# Altium schematic sheet tach.SchDoc
size A4
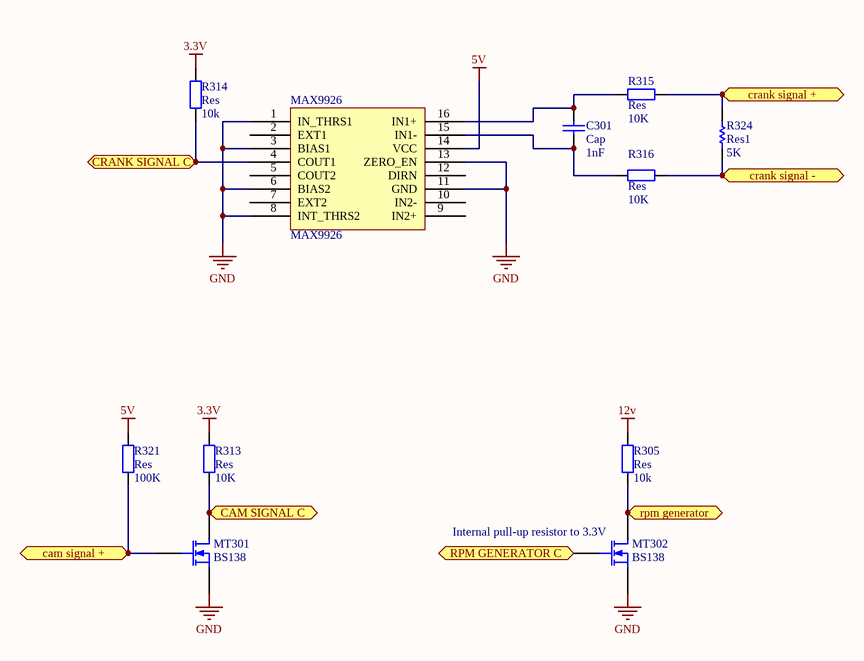
[diagram p0: tach.SchDoc]

## Parts
C301  Cap  value 1nF  [1206 footprint]
MAX9926  MAX9926  [TSSOP-16]
MT301  BS138  [SOT23]
MT302  BS138  [SOT23]
R305  Res  value 10k  [1206 footprint]
R313  Res  value 10K  [1206 footprint]
R314  Res  value 10k  [1206 footprint]
R315  Res  value 10K  [1206 footprint]
R316  Res  value 10K  [1206 footprint]
R321  Res  value 100K  [1206 footprint]
R324  Res1  value 5K  [AXIAL-0.3]

## Ports
cam signal + (bidir), CAM SIGNAL C (bidir), crank signal + (bidir), crank signal - (bidir), CRANK SIGNAL C (bidir), rpm generator (bidir), RPM GENERATOR C (bidir)

## Nets
3.3V: R313.2 R314.2
5V: MAX9926.14(VCC) R321.2
12v: R305.2
GND: MAX9926.1(IN_THRS1) MAX9926.3(BIAS1) MAX9926.6(BIAS2) MAX9926.8(INT_THRS2) MAX9926.11(GND) MAX9926.13(ZERO_EN) MT301.2(S) MT302.2(S)
cam signal +: MT301.1(G) R321.1 ; port cam signal +
CAM SIGNAL C: MT301.3(D) R313.1 ; port CAM SIGNAL C
crank signal +: R315.2 R324.2 ; port crank signal +
crank signal -: R316.2 R324.1 ; port crank signal -
CRANK SIGNAL C: MAX9926.4(COUT1) R314.1 ; port CRANK SIGNAL C
rpm generator: MT302.3(D) R305.1 ; port rpm generator
RPM GENERATOR C: MT302.1(G) ; port RPM GENERATOR C
NetC301_1: C301.1 MAX9926.15(IN1-) R316.1
NetC301_2: C301.2 MAX9926.16(IN1+) R315.1

Not connected (* = marked no-connect by the designer): MAX9926 2(EXT1) 5(COUT2) 7(EXT2) 9(IN2+) 10(IN2-) 12(DIRN)

## Notes on the sheet
- (near MT302) Internal pull-up resistor to 3.3V

## Library data of the parts
R324 = Res1: Resistor; Published: 8-Jun-2000; LatestRevisionDate: 17-Jul-2002; LatestRevisionNote: Re-released for DXP Platform.; PackageReference: AXIAL-0.3; Publisher: Altium Limited; PackageDescription: Axial Device, Thru-Hole; 2 Leads; 0.3 in Pin Spacing